# Altium project LEAKCAM.PrjPcb (part 2 of 2)

## Sheet WIFI.SchDoc
size A2; SheetNumber: 6; SheetTotal: 8
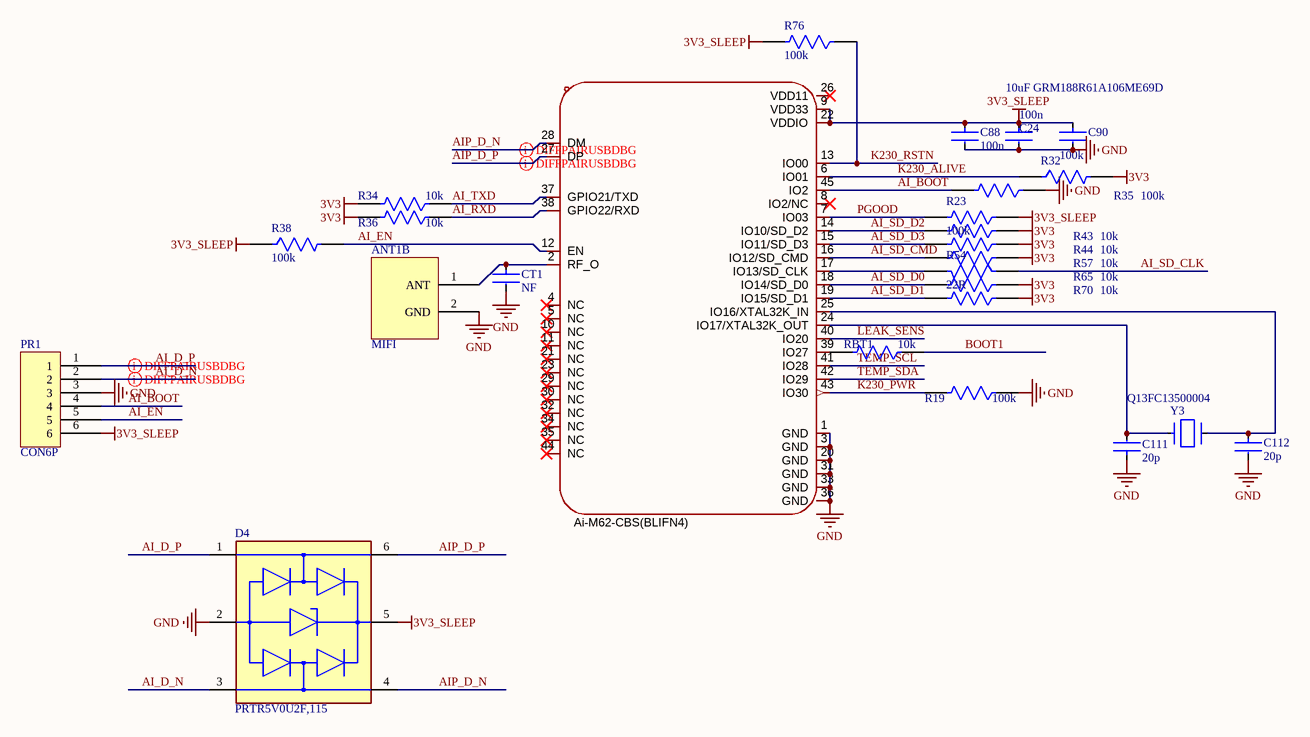
[diagram p5: WIFI.SchDoc]

### Parts
ANT1  MIFI  [IFA_MAGUS]  (part B of 2)  (net tie, no BOM)
C24  100n  [CAP_0402]
C88  100n  [CAP_0402]
C90  10uF GRM188R61A106ME69D  [FP-GRM188-0_15-MFG]
C111  20p  [CAP_0402]
C112  20p  [CAP_0402]
CT1  NF  [CAP_0402]
D4  PRTR5V0U2F,115  [FP-SOT886-MFG]
PR1  CON6P  [CON6P]
R19  100k  [RES_0402]
R23  100k  [RES_0402]
R32  100k  [RES_0402]
R34  10k  [RES_0402]
R35  100k  [RES_0402]
R36  10k  [RES_0402]
R38  100k  [RES_0402]
R43  10k  [RES_0402]
R44  10k  [RES_0402]
R54  22R  [RES_0402]
R57  10k  [RES_0402]
R65  10k  [RES_0402]
R70  10k  [RES_0402]
R76  100k  [RES_0402]
RBT1  10k  [RES_0402]
U11  ai-m62-cbs(blifn4)  [AI-M62-CBS]
Y3  Q13FC13500004  [FP-ABS07-MFG]

### Nets
3V3: R32.2 R34.2 R36.2 R43.1 R44.1 R57.1 R65.1 R70.1
3V3_SLEEP: C24.1 C88.1 C90.1 D4.5(VCC) PR1.6 R23.1 R38.1 R76.2 U11.9(VDD33) U11.22(VDDIO)
GND: ANT1.2(GND) C24.2 C88.2 C90.2 C111.1 C112.2 CT1.2 D4.2(GND) PR1.3 R19.1 R35.1 U11.1(GND) U11.3(GND) U11.20(GND) U11.31(GND) U11.33(GND) U11.36(GND)
AI_BOOT: PR1.4 R35.2 U11.45(IO2)
AI_D_N: D4.3(I/O2) PR1.2
AI_D_P: D4.1(I/O1) PR1.1
AI_EN: PR1.5 R38.2 U11.12(EN)
AI_RXD: R36.1 U11.38(GPIO22/RXD)
AI_SD_CLK: R54.1
AI_SD_CMD: R57.2 U11.16(IO12/SD_CMD)
AI_SD_D0: R65.2 U11.18(IO14/SD_D0)
AI_SD_D1: R70.2 U11.19(IO15/SD_D1)
AI_SD_D2: R43.2 U11.14(IO10/SD_D2)
AI_SD_D3: R44.2 U11.15(IO11/SD_D3)
AI_TXD: R34.1 U11.37(GPIO21/TXD)
AIP_D_N: D4.4(I/O2) U11.28(DM)
AIP_D_P: D4.6(I/O1) U11.27(DP)
BOOT1: RBT1.1
K230_ALIVE: R32.1 U11.6(IO01)
K230_PWR: R19.2 U11.43(IO30)
K230_RSTN: R76.1 U11.13(IO00)
LEAK_SENS: U11.40(IO20)
PGOOD: R23.2 U11.7(IO03)
TEMP_SCL: U11.41(IO28)
TEMP_SDA: U11.42(IO29)
NetANT1_1: ANT1.1(ANT) CT1.1 U11.2(RF_O)
NetC111_2: C111.2 U11.24(IO17/XTAL32K_OUT) Y3.1
NetC112_1: C112.1 U11.25(IO16/XTAL32K_IN) Y3.2
NetR54_2: R54.2 U11.17(IO13/SD_CLK)
NetRBT1_2: RBT1.2 U11.39(IO27)

Not connected (* = marked no-connect by the designer): U11 4(NC)* 5(NC)* 8(IO2/NC)* 10(NC)* 11(NC)* 21(NC)* 23(NC)* 26(VDD11)* 29(NC)* 30(NC)* 32(NC)* 34(NC)* 35(NC)* 44(NC)*

### Layout directives
differential pair; differential pair class USBD: AI_D_N, AI_D_P, AIP_D_N, AIP_D_P

### Library data of the parts
C24 C88 = CMP-03422-001116-1: C307331; Tolerance: 10%; Voltage Rating: 50V; Capacitance: 100nF; Value: 100nF; Max Operating Temperature: 125°C; Case Code (Metric): 1005; RoHS Compliant: Yes; Series: -; Case Code (Imperial): 0402; Min Operating Temperature: -55°C; Mount: Surface Mount; Case/Package: 0402; Packaging: Cut Tape
C90 = CMP-06035-003612-1: C19702; Tolerance: 20%; Dielectric: X5R; Voltage Rating: 10V; Material: Ceramic; Package Quantity: 4000; Width: 0.8mm; Case/Package: 0603; Thickness: 0.035inch; Capacitance: 10uF; Voltage Rating (DC): 10V; Termination: SMD/SMT; Length: 1.6mm; Lead Free: Lead Free; Mount: Surface Mount; Height: 0.8mm; Depth: 0.8mm; Packaging: Tape and Reel; Weight: 0.000222oz; Min Operating Temperature: -55°C; Case Code (Metric): 1608; Max Operating Temperature: 85°C; Case Code (Imperial): 0603; Value: 10uF
C111 C112 = CMP-03422-001116-1: C1554; Tolerance: 10%; Voltage Rating: 50V; Capacitance: 20pF; Value: 20pF; Max Operating Temperature: 125°C; Case Code (Metric): 1005; RoHS Compliant: Yes; Series: -; Case Code (Imperial): 0402; Min Operating Temperature: -55°C; Mount: Surface Mount; Case/Package: 0402; Packaging: Cut Tape
CT1 = CMP-03422-001116-1: Tolerance: 10%; Voltage Rating: 50V; Max Operating Temperature: 125°C; Case Code (Metric): 1005; RoHS Compliant: Yes; Series: -; Case Code (Imperial): 0402; Min Operating Temperature: -55°C; Mount: Surface Mount; Case/Package: 0402; Packaging: Cut Tape
D4 = CMP-14436-000003-1: C478118; Manufacturer: Nexperia; Capacitance: 1pF; Reverse Standoff Voltage: 5.5V; Number Of Channels: 2; Automotive Grade: Grade 3; Direction: Unidirectional; Value: 1pF; Breakdown Voltage: 6V; Octopart: https://octopart.com/prtr5v0u2f%2C115-nexperia-78741690; Height: 0.5mm; Category: Diode; RoHS: TRUE; Automotive: Yes; Digikey Description: TVS DIODE 5.5V 6XSON SOT886; Device Class L1: Circuit Protection; Ambient Temperature Range High: +85°C; ComponentLink2Description: Datasheet; Manufacturer Part Number: PRTR5V0U2F,115; Device Class L3: unset; Footprint Url: https://assets.nexperia.com/documents/outline-drawing/SOT886.pdf; Lead Free: Yes; Ambient Temperature Range Low: -40°C; Device Class L2: TVS Diodes; Package: SOT886; ComponentLink2URL: https://assets.nexperia.com/documents/data-sheet/PRTR5V0U2F_PRTR5V0U2K.pdf
R19 R23 R32 R35 R38 R76 = CMP-03412-016018-1: C25741; Tolerance: 1%; Temperature Coefficient: 100ppm/°C; Resistance: 100kOhm; Max Power Dissipation: 63mW; Value: 100kOhm; Ratings: AEC-Q200; Resistor Type: Thick Film; Number of Terminations: 2; RoHS Compliant: Yes; Min Operating Temperature: -55°C; Case/Package: 0402; Series: AC; Length: 0.039inch; Width: 0.02inch; Features: Moisture Resistant; Height: 0.015inch; Packaging: Tape and Reel; Max Operating Temperature: 155°C
R34 R36 R43 R44 R57 R65 R70 = CMP-03412-016018-1: C25744; Tolerance: 1%; Temperature Coefficient: 100ppm/°C; Resistance: 10kOhm; Max Power Dissipation: 63mW; Value: 10kOhm; Ratings: AEC-Q200; Resistor Type: Thick Film; Number of Terminations: 2; RoHS Compliant: Yes; Min Operating Temperature: -55°C; Case/Package: 0402; Series: AC; Length: 0.039inch; Width: 0.02inch; Features: Moisture Resistant; Height: 0.015inch; Packaging: Tape and Reel; Max Operating Temperature: 155°C
R54 = CMP-03412-016018-1: C25092; Tolerance: 1%; Temperature Coefficient: 100ppm/°C; Resistance: 22Ohm; Max Power Dissipation: 63mW; Value: 22Ohm; Ratings: AEC-Q200; Resistor Type: Thick Film; Number of Terminations: 2; RoHS Compliant: Yes; Min Operating Temperature: -55°C; Case/Package: 0402; Series: AC; Length: 0.039inch; Width: 0.02inch; Features: Moisture Resistant; Height: 0.015inch; Packaging: Tape and Reel; Max Operating Temperature: 155°C
RBT1 = CMP-03412-016018-1: C25744; Tolerance: 1%; Temperature Coefficient: 100ppm/°C; Resistance: 768kR; Max Power Dissipation: 63mW; Ratings: AEC-Q200; Resistor Type: Thick Film; Number of Terminations: 2; RoHS Compliant: Yes; Min Operating Temperature: -55°C; Case/Package: 0402; Series: AC; Length: 0.039inch; Width: 0.02inch; Features: Moisture Resistant; Height: 0.015inch; Packaging: Tape and Reel; Max Operating Temperature: 155°C
U11 = ai-m62-cbs(blifn4): C41368035; Manufacturer: Ai-Thinker(安信可); Utilized IC / Part: BL616; AddInBom: yes; ModelId: 220c4423d0fa4477abd1b31893269491; ModelName: WIRELM-SMD_AI-M62-CBS; ModelTransform: 472.44,472.44,0,0,0,0,0.001,0.005,0; Interface Type: I2C；GPIO；UART；USB2.0；SPI；PWM；SDIO；I2S; Output Power: 22dBm; Voltage - Supply: 2.97V~3.6V; Receive  Current: 59mA; Send  Current: 394mA; Sensitivity: -98dBm; LCSC Part Name: Wi-Fi6+BLE5.3模组; SupplierPart: C41368035; ManufacturerPart: Ai-M62-CBS(BLIFN4); Supplier Footprint: SMD,12x12mm; JLCPCB Part Class: Extended Part; Datasheet: https://item.szlcsc.com/datasheet/Ai-M62-CBS(BLIFN4)/43122706.html; Supplier: LCSC; ConvertToPcb: yes; SymbolName: AI-M62-CBS(BLIFN4); FootprintName: WIRELM-SMD_AI-M62-CBS; Operating Temperature: -40℃~+85℃
Y3 = CMP-0447-00001-4: C32346; Frequency: 32.768kHz; ESR (Equivalent Series Resistance): 70kR; Frequency Tolerance: 20ppm; Load Capacitance: 12.5pF; Operating Frequency: 32.768 kHz; Radiation Hardening: No; Length: 3.2mm; Max Operating Temperature: 85°C; Number of Pins: 2; Series: ABS07; Min Operating Temperature: -40°C; Packaging: Tape and Reel; Height: 0.9mm; Width: 1.5mm; Depth: 1.5mm; RoHS Compliant: Yes; Tolerance: 20ppm; Termination: SMD/SMT; Lead Free: Lead Free; Series Resistance: 70kR; REACH SVHC: No SVHC; Case/Package: CSMD; Package Quantity: 3000

## Sheet LEDS.SchDoc
size A2; SheetNumber: 7; SheetTotal: 8
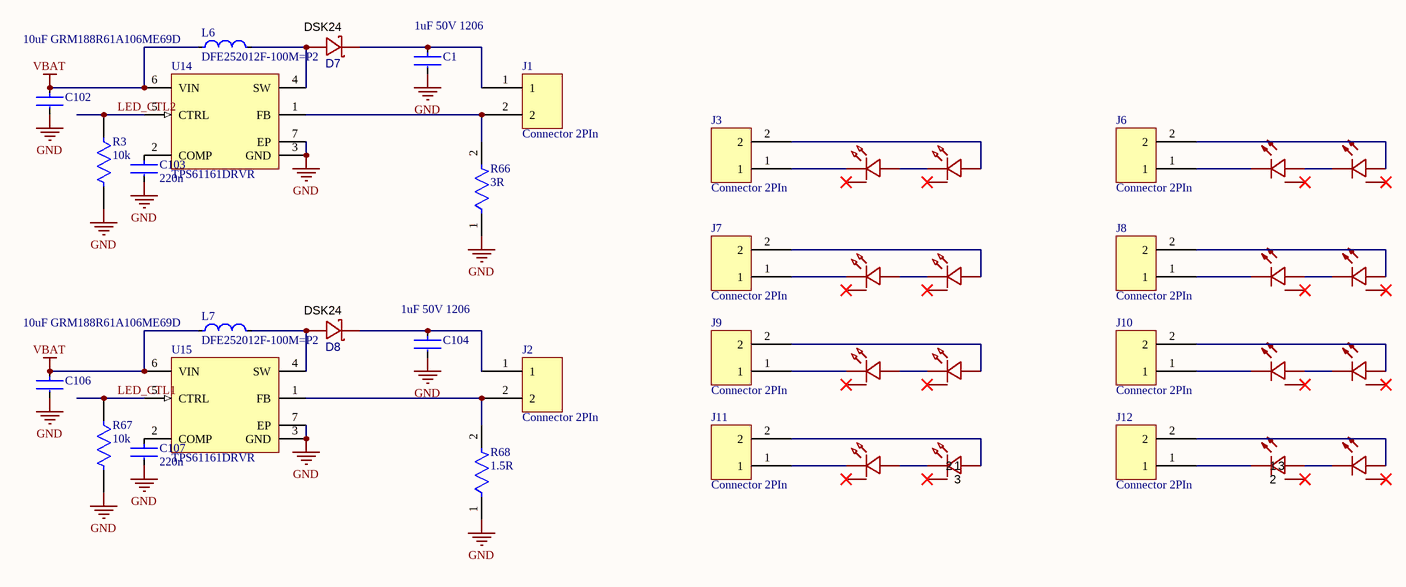
[diagram p6: LEDS.SchDoc]

### Parts
C1  1uF 50V 1206  [FP-1206-L_3_2_0_2-W_1_6_0-IPC_B]
C102  10uF GRM188R61A106ME69D  [FP-GRM188-0_15-MFG]
C103  220n  [CAP_0402]
C104  1uF 50V 1206  [FP-1206-L_3_2_0_2-W_1_6_0-IPC_B]
C106  10uF GRM188R61A106ME69D  [FP-GRM188-0_15-MFG]
C107  220n  [CAP_0402]
D7  DSK24  [DSK24]
D8  DSK24  [DSK24]
J1  Connector 2PIn  [CON_2P]
J2  Connector 2PIn  [CON_2P]
J3  Connector 2PIn  [CON_2P]
J6  Connector 2PIn  [CON_2P]
J7  Connector 2PIn  [CON_2P]
J8  Connector 2PIn  [CON_2P]
J9  Connector 2PIn  [CON_2P]
J10  Connector 2PIn  [CON_2P]
J11  Connector 2PIn  [CON_2P]
J12  Connector 2PIn  [CON_2P]
L6  DFE252012F-100M=P2  [FP-DFE252012C-IPC_B]
L7  DFE252012F-100M=P2  [FP-DFE252012C-IPC_B]
LED1  xl-hd3535uwc-a2  [XL-HD3535UWC-A2]  (value not drawn)
LED2  xl-hd3535uwc-a2  [XL-HD3535UWC-A2]  (value not drawn)
LED3  jnj-ltji0112w120/35mil/845-860nm  [JNJ-LTJI0112W120]  (value not drawn)
LED4  xl-hd3535uwc-a2  [XL-HD3535UWC-A2]  (value not drawn)
LED5  xl-hd3535uwc-a2  [XL-HD3535UWC-A2]  (value not drawn)
LED6  jnj-ltji0112w120/35mil/845-860nm  [JNJ-LTJI0112W120]  (value not drawn)
LED7  jnj-ltji0112w120/35mil/845-860nm  [JNJ-LTJI0112W120]  (value not drawn)
LED8  xl-hd3535uwc-a2  [XL-HD3535UWC-A2]  (value not drawn)
LED9  xl-hd3535uwc-a2  [XL-HD3535UWC-A2]  (value not drawn)
LED10  jnj-ltji0112w120/35mil/845-860nm  [JNJ-LTJI0112W120]  (value not drawn)
LED11  jnj-ltji0112w120/35mil/845-860nm  [JNJ-LTJI0112W120]  (value not drawn)
LED12  xl-hd3535uwc-a2  [XL-HD3535UWC-A2]  (value not drawn)
LED13  xl-hd3535uwc-a2  [XL-HD3535UWC-A2]  (value not drawn)
LED14  jnj-ltji0112w120/35mil/845-860nm  [JNJ-LTJI0112W120]  (value not drawn)
LED15  jnj-ltji0112w120/35mil/845-860nm  [JNJ-LTJI0112W120]  (value not drawn)
LED16  jnj-ltji0112w120/35mil/845-860nm  [JNJ-LTJI0112W120]  (value not drawn)
R3  10k  [RES_0402]
R66  3R  [FP-SR0603-MFG]
R67  10k  [RES_0402]
R68  1.5R  [FP-SR0603-MFG]
U14  TPS61161DRVR  [TPS61160ADRVT]
U15  TPS61161DRVR  [TPS61160ADRVT]

### Nets
GND: C1.2 C102.2 C103.2 C104.2 C106.2 C107.2 R3.2 R66.1 R67.2 R68.1 U14.3(GND) U14.7(EP) U15.3(GND) U15.7(EP)
VBAT: C102.1 C106.1 L6.1 L7.1 U14.6(VIN) U15.6(VIN)
LED_CTL1: R67.1 U15.5(CTRL)
LED_CTL2: R3.1 U14.5(CTRL)
NetC1_1: C1.1 D7.1(K) J1.1
NetC103_1: C103.1 U14.2(COMP)
NetC104_1: C104.1 D8.1(K) J2.1
NetC107_1: C107.1 U15.2(COMP)
NetD7_2: D7.2(A) L6.2 U14.4(SW)
NetD8_2: D8.2(A) L7.2 U15.4(SW)
NetJ1_2: J1.2 R66.2 U14.1(FB)
NetJ2_2: J2.2 R68.2 U15.1(FB)
NetJ3_1: J3.1 LED1.1
NetJ3_2: J3.2 LED2.2
NetJ6_1: J6.1 LED16.3
NetJ6_2: J6.2 LED3.1
NetJ7_1: J7.1 LED4.1
NetJ7_2: J7.2 LED5.2
NetJ8_1: J8.1 LED6.3
NetJ8_2: J8.2 LED7.1
NetJ9_1: J9.1 LED8.1
NetJ9_2: J9.2 LED9.2
NetJ10_1: J10.1 LED10.3
NetJ10_2: J10.2 LED11.1
NetJ11_1: J11.1 LED12.1
NetJ11_2: J11.2 LED13.2
NetJ12_1: J12.1 LED14.3
NetJ12_2: J12.2 LED15.1
NetLED1_2: LED1.2 LED2.1
NetLED3_3: LED3.3 LED16.1
NetLED4_2: LED4.2 LED5.1
NetLED6_1: LED6.1 LED7.3
NetLED8_2: LED8.2 LED9.1
NetLED10_1: LED10.1 LED11.3
NetLED12_2: LED12.2 LED13.1
NetLED14_1: LED14.1 LED15.3

Not connected (* = marked no-connect by the designer): LED1 3*; LED2 3*; LED3 2*; LED4 3*; LED5 3*; LED6 2*; LED7 2*; LED8 3*; LED9 3*; LED10 2*; LED11 2*; LED12 3*; LED13 3*; LED14 2*; LED15 2*; LED16 2*

### Library data of the parts
C1 C104 = CMP-04427-010925-1: C1848; Tolerance: 5%; Dielectric: X7R; Mount: Surface Mount; Min Operating Temperature: -55°C; Voltage Rating (DC): 50V; Ratings: AEC-Q200; RoHS Compliant: Yes; Max Operating Temperature: 125°C; Width: 0.063inch; Voltage Rating: 50V; Thickness: 0.037inch; Package Quantity: 2000; Capacitance: 1uF; Packaging: Tape and Reel; Length: 0.126inch; Case/Package: 1206; Value: 1uF
C102 C106 = CMP-06035-003612-1: as C90 on sheet WIFI; Package Quantity: 4000; Width: 0.8mm; Case/Package: 0603; Thickness: 0.035inch; Capacitance: 10uF; Voltage Rating (DC): 10V; Termination: SMD/SMT; Length: 1.6mm; Lead Free: Lead Free; Mount: Surface Mount; Height: 0.8mm; Depth: 0.8mm; Packaging: Tape and Reel; Weight: 0.000222oz; Min Operating Temperature: -55°C; Case Code (Metric): 1608; Max Operating Temperature: 85°C; Case Code (Imperial): 0603; Value: 10uF
C103 C107 = CMP-03422-001116-1: C16772; Tolerance: 10%; Voltage Rating: 50V; Capacitance: 220nF; Value: 220nF; Max Operating Temperature: 125°C; Case Code (Metric): 1005; RoHS Compliant: Yes; Series: -; Case Code (Imperial): 0402; Min Operating Temperature: -55°C; Mount: Surface Mount; Case/Package: 0402; Packaging: Cut Tape
D7 D8 = dsk24_c64890: C22466352; Manufacturer: MDD(辰达半导体); Symbol: DSK24 K24; AddInBom: yes; ModelId: 560a7cf99d0e44cb9af362aaf5d7923d; ModelName: SOD-123_L2.8-W1.8-LS3.7-RD; ModelTransform: 144.8816,62.992,0,0,0,0,0,0,0; Diode Configuration: Independent; Voltage - Forward(Vf@If): 550mV@2A; Voltage - DC Reverse(Vr): 40V; Current - Rectified: 2A; Reverse Leakage Current (Ir): 500uA@40V; Operating Junction Temperature Range: -55℃~+150℃; LCSC Part Name: 电压:40V 电流:2A; SupplierPart: C64890; ManufacturerPart: DSK24; Supplier Footprint: SOD-123FL; JLCPCB Part Class: Extended Part; Datasheet: https://item.szlcsc.com/datasheet/DSK24/65960.html; Supplier: LCSC; ConvertToPcb: yes; FootprintName: SOD-123_L2.8-W1.8-LS3.7-RD
J1-J3 J6-J12 = CON2P
L6 L7 = CMP-06042-007232-1: C703141; DC Resistance (DCR): 480mR; Current Rating: 950mA; Inductance: 10uH; Tolerance: 20%; Test Frequency: 1MHz; Shielding: Shielded; Saturation Current: 1.6A; Core Material: Ferrite; Value: 10uH; Case/Package: 1008; Length: 0.098inch; Case Code (Metric): 2520; Width: 0.079inch; Case Code (Imperial): 1008; Height - Seated (Max): 0.047inch; Packaging: Tape and Reel; Mount: Surface Mount; Min Operating Temperature: -40°C; Max Operating Temperature: 125°C
LED1 LED2 LED4 LED5 LED8 LED9 LED12 LED13 = xl-hd3535uwc-a2: C3646951; Manufacturer: XINGLIGHT(成兴光); AddInBom: yes; ModelId: 24cabb2563c34a16901b89b669d22d94; ModelName: LED-SMD_3P-L3.5-W3.5_XL-HD3535UWC-A2-3; ModelTransform: 135.827,135.86587,0,0,0,0,0,0,0; Lamp Holder Type: 3.5mm x 3.5mm square LED; Illumination Color: White; Voltage - Forward(Vf): 2.8V~3.6V; Power(Watts): 1W; Forward Current: 350mA; Diode Configuration: Discrete Diode; Lens Color: Water Clear; Color Temperature: 5500K~7000K; Viewing Angle: 130°; Symbol: XL-HD3535UWC-A2; LCSC Part Name: 3535球头白1W贴片式发光二极管; SupplierPart: C3646951; ManufacturerPart: XL-HD3535UWC-A2; Supplier Footprint: SMD3535-3P; JLCPCB Part Class: Extended Part; Datasheet: https://item.szlcsc.com/datasheet/XL-HD3535UWC-A2/4213794.html; Supplier: LCSC; ConvertToPcb: yes; FootprintName: LED-SMD_3P-L3.5-W3.5_XL-HD3535UWC-A2-3; Wavelength - Dominant: -; Peak Wavelength: -; Luminous Intensity: -; Mounting Style: Top-mount; Operating Temperature: -40℃~+85℃
LED3 LED6 LED7 LED10 LED11 LED14-LED16 = jnj-ltji0112w120/35mil/845-860nm: C19185834; Manufacturer: JNJOPTO(强生光电); AddInBom: yes; ModelId: ae706680f6654db0b87a2ee284df6a85; ModelName: LED-SMD_3P-L3.5-W3.5_JNJ-LTJID0114T140; ModelTransform: 137.795,138.1887,0,0,0,0,0,0,0; Voltage - Forward(Vf): 1.4V~2.1V；1.5V~2.3V; Wavelength: 850nm; Radiant Intensity: 75mW/sr@IF=350mA；140mW/sr@IF=1000mA; Current - DC Forward(If): 1A; Voltage - DC Reverse(Vr): 5V; Viewing Angle: 120°; Half wave width: 50nm; Symbol: JNJ-LTJI0112W120/35MIL/845-860NM; LCSC Part Name: 3535白色陶瓷晶元35mil球头120度灯源845-860nm; SupplierPart: C19185834; ManufacturerPart: JNJ-LTJI0112W120/35mil/845-860nm; Supplier Footprint: SMD3535-3P; JLCPCB Part Class: Extended Part; Datasheet: https://item.szlcsc.com/datasheet/JNJ-LTJI0112W120%252F35mil%252F845-860nm/20403639.html; Supplier: LCSC; ConvertToPcb: yes; FootprintName: LED-SMD_3P-L3.5-W3.5_JNJ-LTJID0114T140; Pd - Power Dissipation: -; Operating Temperature: -40℃~+100℃
R3 R67 = CMP-03412-016018-1: as R34 on sheet WIFI; Ratings: AEC-Q200; Resistor Type: Thick Film; Number of Terminations: 2; RoHS Compliant: Yes; Min Operating Temperature: -55°C; Case/Package: 0402; Series: AC; Length: 0.039inch; Width: 0.02inch; Features: Moisture Resistant; Height: 0.015inch; Packaging: Tape and Reel; Max Operating Temperature: 155°C
R66 = CMP-03412-016018-1: C23157; Manufacturer Part Number: SR0603FR-7T10RL; Manufacturer: Yageo; Voltage Rating: 75V; Value: 3Ohm; Tolerance: 0.01; Automotive Grade: Grade 0; Power Rating: 0.25W; Footprint Url: http://www.yageo.com/exep/pages/download/literatures/PYu-R_Mount_10.pdf; Digikey Description: RES SMD 0603 1/10W 1% 3 OHM; Device Class L2: Resistors; Octopart: https://octopart.com/sr0603fr-7t10rl-yageo-91478074; Temperature Range Low: -55°C; Device Class L3: Chip SMD Resistors; ComponentLink2Description: Datasheet; Height: 0.55mm; Automotive: Yes; Lead Free: Yes; Category: Res; Resistance: 3Ohm; RoHS: TRUE; Series: SR; Temperature: -55°C to +155°C; Device Class L1: Passive Components; Temperature Range High: +155°C; Composition: Thick Film; Package: SR0603; ComponentLink2URL: http://www.yageo.com/documents/recent/PYu-SR_D_F%20tol_RoHS_L_3.pdf; Ipc Land Pattern Name: RESC16080X45
R68 = CMP-03412-016018-1: C22769; Manufacturer Part Number: SR0603FR-7T10RL; Manufacturer: Yageo; Voltage Rating: 75V; Value: 1.5Ohm; Tolerance: 0.01; Automotive Grade: Grade 0; Power Rating: 0.25W; Footprint Url: http://www.yageo.com/exep/pages/download/literatures/PYu-R_Mount_10.pdf; Digikey Description: RES SMD 0603 1/10W 1% 1.5 OHM; Device Class L2: Resistors; Octopart: https://octopart.com/sr0603fr-7t10rl-yageo-91478074; Temperature Range Low: -55°C; Device Class L3: Chip SMD Resistors; ComponentLink2Description: Datasheet; Height: 0.55mm; Automotive: Yes; Lead Free: Yes; Category: Res; Resistance: 1.5Ohm; RoHS: TRUE; Series: SR; Temperature: -55°C to +155°C; Device Class L1: Passive Components; Temperature Range High: +155°C; Composition: Thick Film; Package: SR0603; ComponentLink2URL: http://www.yageo.com/documents/recent/PYu-SR_D_F%20tol_RoHS_L_3.pdf; Ipc Land Pattern Name: RESC16080X45
U14 U15 = TI-TPS6116XDRV6-1600X1000TP: C324075; Manufacturer: Texas Instruments; Dimming: TRUE; Vin(Max)(V): 18; Vin(Min)(V): 2.7; SubFamily: White LED Driver; Iq(Typ)(mA): 1.5; Switching Frequency(Max)(kHz): 600; Topology: Boost; Rating: Catalog; Eco-Plan: Green (RoHS & no Sb/Br); ComponentLink2Description: Datasheet; Mounting Technology: Surface Mount; DatasheetVersion: SLVS937A; PackageReference: DRV0006A; PartNumber: TPS61161DRVR; ComponentLink2URL: http://www.ti.com/general/docs/lit/getliterature.tsp?genericPartNumber=TPS61160A&fileType=pdf; ComponentLink1URL: http://www.ti.com/; ComponentLink3Description: Package Specification; Synchronous Rectification: TRUE; PackageDescription: 6-Pin Plastic Small Outline No-Lead, Body 2 x 2 mm, Pitch 0.65 mm; ComponentLink3URL: http://www.ti.com/litv/pdf/mpds216d; ComponentLink1Description: Manufacturer URL; PackageVersion: 4206925/E

## Sheet SENS.SchDoc
size A2; SheetNumber: 8; SheetTotal: 8
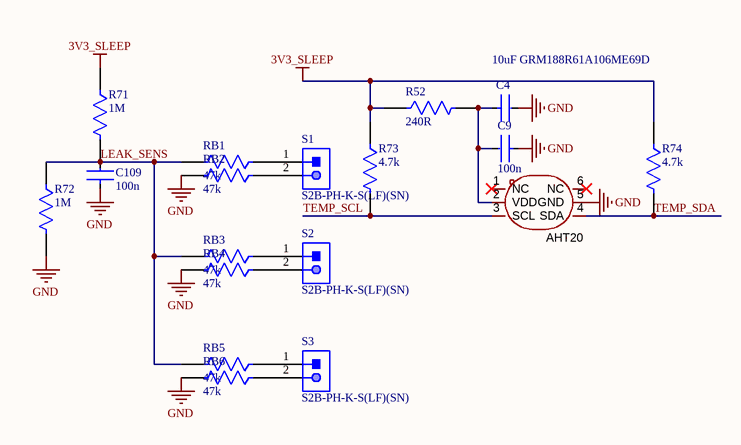
[diagram p7: SENS.SchDoc]

### Parts
C4  10uF GRM188R61A106ME69D  [FP-GRM188-0_15-MFG]
C9  100n  [CAP_0402]
C109  100n  [CAP_0402]
R52  240R  [RES_0402]
R71  1M  [RES_0402]
R72  1M  [RES_0402]
R73  4.7k  [RES_0402]
R74  4.7k  [RES_0402]
RB1  47k  [RES_0402]
RB2  47k  [RES_0402]
RB3  47k  [RES_0402]
RB4  47k  [RES_0402]
RB5  47k  [RES_0402]
RB6  47k  [RES_0402]
S1  S2B-PH-K-S(LF)(SN)  [JST-S2B-PH-K-S_V]
S2  S2B-PH-K-S(LF)(SN)  [JST-S2B-PH-K-S_V]
S3  S2B-PH-K-S(LF)(SN)  [JST-S2B-PH-K-S_V]
U17  AHT20  [AHT30]

### Nets
3V3_SLEEP: R52.1 R71.1 R73.1 R74.1
GND: C4.2 C9.1 C109.1 R72.2 RB2.2 RB4.2 RB6.2 U17.5(GND)
LEAK_SENS: C109.2 R71.2 R72.1 RB1.2 RB3.2 RB5.2
TEMP_SCL: R73.2 U17.3(SCL)
TEMP_SDA: R74.2 U17.4(SDA)
NetC4_1: C4.1 C9.2 R52.2 U17.2(VDD)
NetRB1_1: RB1.1 S1.1
NetRB2_1: RB2.1 S1.2
NetRB3_1: RB3.1 S2.1
NetRB4_1: RB4.1 S2.2
NetRB5_1: RB5.1 S3.1
NetRB6_1: RB6.1 S3.2

Not connected (* = marked no-connect by the designer): U17 1(NC)* 6(NC)*

### Library data of the parts
C4 = CMP-06035-003612-1: as C90 on sheet WIFI; Package Quantity: 4000; Width: 0.8mm; Case/Package: 0603; Thickness: 0.035inch; Capacitance: 10uF; Voltage Rating (DC): 10V; Termination: SMD/SMT; Length: 1.6mm; Lead Free: Lead Free; Mount: Surface Mount; Height: 0.8mm; Depth: 0.8mm; Packaging: Tape and Reel; Weight: 0.000222oz; Min Operating Temperature: -55°C; Case Code (Metric): 1608; Max Operating Temperature: 85°C; Case Code (Imperial): 0603; Value: 10uF
C9 C109 = CMP-03422-001116-1: as C24 on sheet WIFI; Max Operating Temperature: 125°C; Case Code (Metric): 1005; RoHS Compliant: Yes; Series: -; Case Code (Imperial): 0402; Min Operating Temperature: -55°C; Mount: Surface Mount; Case/Package: 0402; Packaging: Cut Tape
R52 = CMP-03412-016018-1: C324768; Tolerance: 1%; Temperature Coefficient: 100ppm/°C; Resistance: 240Ohm; Max Power Dissipation: 63mW; Value: 240Ohm; Ratings: AEC-Q200; Resistor Type: Thick Film; Number of Terminations: 2; RoHS Compliant: Yes; Min Operating Temperature: -55°C; Case/Package: 0402; Series: AC; Length: 0.039inch; Width: 0.02inch; Features: Moisture Resistant; Height: 0.015inch; Packaging: Tape and Reel; Max Operating Temperature: 155°C
R71 R72 = CMP-03412-016018-1: C26083; Tolerance: 1%; Temperature Coefficient: 100ppm/°C; Resistance: 1MOhm; Max Power Dissipation: 63mW; Value: 1MOhm; Ratings: AEC-Q200; Resistor Type: Thick Film; Number of Terminations: 2; RoHS Compliant: Yes; Min Operating Temperature: -55°C; Case/Package: 0402; Series: AC; Length: 0.039inch; Width: 0.02inch; Features: Moisture Resistant; Height: 0.015inch; Packaging: Tape and Reel; Max Operating Temperature: 155°C
R73 R74 = CMP-03412-016018-1: C25900; Tolerance: 1%; Temperature Coefficient: 100ppm/°C; Resistance: 4.7kOhm; Max Power Dissipation: 63mW; Value: 4.7kOhm; Ratings: AEC-Q200; Resistor Type: Thick Film; Number of Terminations: 2; RoHS Compliant: Yes; Min Operating Temperature: -55°C; Case/Package: 0402; Series: AC; Length: 0.039inch; Width: 0.02inch; Features: Moisture Resistant; Height: 0.015inch; Packaging: Tape and Reel; Max Operating Temperature: 155°C
RB1-RB6 = CMP-03412-016018-1: C25792; Tolerance: 1%; Temperature Coefficient: 100ppm/°C; Resistance: 47kOhm; Max Power Dissipation: 63mW; Value: 47kOhm; Ratings: AEC-Q200; Resistor Type: Thick Film; Number of Terminations: 2; RoHS Compliant: Yes; Min Operating Temperature: -55°C; Case/Package: 0402; Series: AC; Length: 0.039inch; Width: 0.02inch; Features: Moisture Resistant; Height: 0.015inch; Packaging: Tape and Reel; Max Operating Temperature: 155°C
S1-S3 = CMP-1755-00004-1: C157932; Case\Package: Radial; Tolerance: 20%; Capacitance: 10 uF; Voltage Rating (DC): 50 V; Packaging: Bulk; ComponentLink1URL: http://www.jst-mfg.com/product/pdf/eng/ePH.pdf; Radiation Hardening: No; Height: 11 mm; Package Quantity: 200; PackageDescription: Male Header, Pitch 2 mm, 1 x 2 Position, Height 4.8 mm, Tail Length 3.4 mm; PackageReference: S2B-PH-K-S; Diameter: 5 mm; Pins: 2; Mount: Through Hole; Max Operating Temperature: 85 degC; Min Operating Temperature: -40 degC; ComponentLink1Description: Datasheet; DatasheetVersion: Dec-12; Length: 11 mm; Lead Pitch: 2 mm; REACH SVHC: No SVHC; Voltage Rating: 50 V; RoHSCompliant: true
U17 = aht30_c45354925: C2757850; Manufacturer: 广州奥松; AddInBom: yes; ModelId: 157746d41b2d4f19849b880ea67ac3ea; ModelName: MIC-SMD_6P-L3.0-W3.0-P1.00-TL; ModelTransform: 118.11,118.11,0,0,0,0,0.006,-0.001,0; Humidity: 0%RH~100%RH; Interface: I2C; Voltage - Supply: 2.2V~5.5V; Current - Supply: 570uA; Humidity Tolerance: ±3%RH; Temperature Tolerance: ±0.5℃; Symbol: AHT30_C45354925; LCSC Part Name: 温湿度传感器; SupplierPart: C45354925; ManufacturerPart: AHT30; Supplier Footprint: SMD-6P,3x3mm; JLCPCB Part Class: Extended Part; Datasheet: https://item.szlcsc.com/datasheet/AHT30/47444209.html; Supplier: LCSC; ConvertToPcb: yes; FootprintName: MIC-SMD_6P-L3.0-W3.0-P1.00-TL; Temperature Range: -40℃~+120℃; Resolution: -; Features: Factory calibration

## Nets that join several sheets
0V8: LEAKCAM (50 pins), POWER (6 pins)
0V8_MIPI: LEAKCAM (C28.1 C31.1 U3.M4 U3.N5), POWER (C41.1 FB3.2)
1V1: LEAKCAM (20 pins), POWER (C20.1 C22.1 L2.2 R26.2)
1V8: LEAKCAM (23 pins), POWER (6 pins)
1V8_DDR: LEAKCAM (C43.1 U3.H12), POWER (FB2.2)
1V8_MIPI: LEAKCAM (C27.1 C30.1 U3.L4 U3.M6), POWER (FB1.2)
3V3: LEAKCAM (20 pins), POWER (C87.1 R50.2 RD2.1 U8.6), FLASH (C32.1 C86.1 U16.8), DBG (6 pins), CAM (10 pins), WIFI (8 pins)
3V3_SLEEP: POWER (C14.1 R22.2 U5.6), WIFI (10 pins), SENS (R52.1 R71.1 R73.1 R74.1)
GND: LEAKCAM (154 pins), POWER (57 pins), FLASH (C32.2 C86.2 U16.4 U16.9), DBG (12 pins), CAM (20 pins), WIFI (17 pins), LEDS (14 pins), SENS (8 pins)
VBAT: LEAKCAM (Q1.2 R58.2), POWER (15 pins), LEDS (6 pins)
VUSB: LEAKCAM (R63.2), POWER (6 pins), DBG (D2.1 D3.5)
AI_RXD: LEAKCAM (U3.D2), WIFI (R36.1 U11.38)
AI_SD_CLK: LEAKCAM (U3.B14), WIFI (R54.1)
AI_SD_CMD: LEAKCAM (U3.A14), WIFI (R57.2 U11.16)
AI_SD_D0: LEAKCAM (U3.A12), WIFI (R65.2 U11.18)
AI_SD_D1: LEAKCAM (U3.A10), WIFI (R70.2 U11.19)
AI_SD_D2: LEAKCAM (U3.A11), WIFI (R43.2 U11.14)
AI_SD_D3: LEAKCAM (U3.A13), WIFI (R44.2 U11.15)
AI_TXD: LEAKCAM (U3.C1), WIFI (R34.1 U11.37)
BOOT1: LEAKCAM (B1_N.1 R31.1 U3.C15), WIFI (RBT1.1)
CAM1_C_N: LEAKCAM (U3.K1), CAM (J5.8)
CAM1_C_P: LEAKCAM (U3.K2), CAM (J5.9)
CAM1_D0_N: LEAKCAM (U3.L2), CAM (J5.2)
CAM1_D0_P: LEAKCAM (U3.L1), CAM (J5.3)
CAM1_D1_N: LEAKCAM (U3.M2), CAM (J5.5)
CAM1_D1_P: LEAKCAM (U3.M1), CAM (J5.6)
CAM1_GPIO: LEAKCAM (U3.L13), CAM (J5.18)
CAM1_SCL: LEAKCAM (U3.M16), CAM (J5.20 R17.1)
CAM1_SDA: LEAKCAM (U3.N16), CAM (J5.21 R18.1)
CAM2_C_N: LEAKCAM (U3.P1), CAM (J4.8)
CAM2_C_P: LEAKCAM (U3.P2), CAM (J4.9)
CAM2_D0_N: LEAKCAM (U3.R2), CAM (J4.2)
CAM2_D0_P: LEAKCAM (U3.T2), CAM (J4.3)
CAM2_D1_N: LEAKCAM (U3.N1), CAM (J4.5)
CAM2_D1_P: LEAKCAM (U3.N2), CAM (J4.6)
CAM2_GPIO: LEAKCAM (U3.M13), CAM (J4.18)
CAM2_SCL: LEAKCAM (U3.D3), CAM (J4.20 R14.1)
CAM2_SDA: LEAKCAM (U3.C3), CAM (J4.21 R15.1)
DBG_RXD: LEAKCAM (U3.D1), DBG (R10.2 U2.8)
DBG_TXD: LEAKCAM (U3.E3), DBG (R2.2 U2.9)
K230_ALIVE: LEAKCAM (U3.L14), WIFI (R32.1 U11.6)
K230_PWR: POWER (R27.2 R28.2 R51.2), WIFI (R19.2 U11.43)
K230_RSTN: LEAKCAM (Q4.1), WIFI (R76.1 U11.13)
LEAK_SENS: WIFI (U11.40), SENS (6 pins)
LED_CTL1: LEAKCAM (U3.N3), LEDS (R67.1 U15.5)
LED_CTL2: LEAKCAM (U3.P3), LEDS (R3.1 U14.5)
PGOOD: POWER (U1.7), WIFI (R23.2 U11.7)
RSTN: LEAKCAM (C23.1 Q4.3 R30.2 U3.C12), POWER (U7.8)
SPI_CLK: LEAKCAM (R42.2), FLASH (U16.6)
SPI_CS: LEAKCAM (R39.1 U3.E2), FLASH (U16.1)
SPI_IO0: LEAKCAM (U3.F2), FLASH (U16.5)
SPI_IO1: LEAKCAM (U3.F1), FLASH (U16.2)
SPI_IO2: LEAKCAM (R40.1 U3.G1), FLASH (U16.3)
SPI_IO3: LEAKCAM (R41.2 U3.G2), FLASH (U16.7)
TEMP_SCL: WIFI (U11.41), SENS (R73.2 U17.3)
TEMP_SDA: WIFI (U11.42), SENS (R74.2 U17.4)
USBP_D_N: LEAKCAM (U3.A8), POWER (D5.4)
USBP_D_P: LEAKCAM (U3.B8), POWER (D5.6)